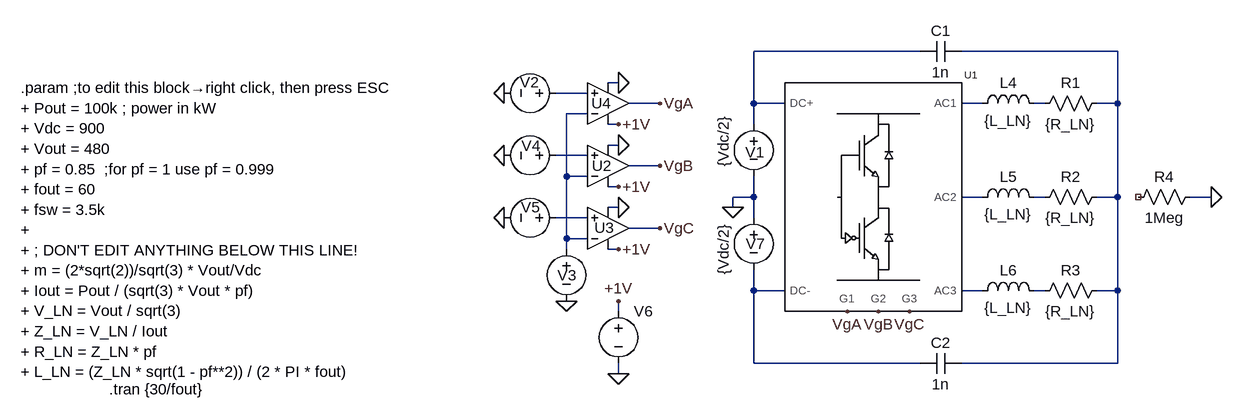
[diagram p0: schematic Inverter using B6CI block.asc]
Inverter using B6CI block.asc, the LTspice schematic file:
Version 4
SHEET 1 1528 680
WIRE 240 -80 -16 -80
WIRE 544 -80 304 -80
WIRE -224 -32 -240 -32
WIRE -272 -16 -320 -16
WIRE -160 0 -208 0
WIRE -16 0 -16 -80
WIRE 32 0 -16 0
WIRE 336 0 304 0
WIRE 432 0 416 0
WIRE 544 0 544 -80
WIRE 544 0 512 0
WIRE -272 16 -304 16
WIRE -224 32 -240 32
WIRE -16 32 -16 0
WIRE -224 64 -240 64
WIRE -272 80 -320 80
WIRE -160 96 -208 96
WIRE -304 112 -304 16
WIRE -272 112 -304 112
WIRE -224 128 -240 128
WIRE -16 144 -16 112
WIRE -16 144 -48 144
WIRE 336 144 304 144
WIRE 432 144 416 144
WIRE 544 144 544 0
WIRE 544 144 512 144
WIRE 688 144 656 144
WIRE -224 160 -240 160
WIRE -48 160 -48 144
WIRE -272 176 -320 176
WIRE -16 176 -16 144
WIRE -160 192 -208 192
WIRE -304 208 -304 112
WIRE -272 208 -304 208
WIRE -304 224 -304 208
WIRE -224 224 -240 224
WIRE -16 288 -16 256
WIRE 32 288 -16 288
WIRE 336 288 304 288
WIRE 432 288 416 288
WIRE 544 288 544 144
WIRE 544 288 512 288
WIRE -224 320 -224 304
WIRE -16 400 -16 288
WIRE 240 400 -16 400
WIRE 544 400 544 288
WIRE 544 400 304 400
WIRE -224 416 -224 400
FLAG -400 -16 0
FLAG -400 80 0
FLAG -400 176 0
FLAG -304 304 0
FLAG -224 32 +1V
FLAG -224 128 +1V
FLAG -224 224 +1V
FLAG -224 304 +1V
FLAG -224 416 0
FLAG -160 0 VgA
FLAG -160 96 VgB
FLAG -160 192 VgC
FLAG -224 -32 0
FLAG -224 64 0
FLAG -224 160 0
FLAG 688 144 0
FLAG 128 320 VgA
FLAG 176 320 VgB
FLAG 224 320 VgC
FLAG -48 160 0
SYMBOL IDEAL_B6CI 176 144 R0
SYMATTR InstName U1
SYMBOL voltage -16 16 R0
WINDOW 123 0 0 Left 2
WINDOW 39 0 0 Left 2
WINDOW 0 -13 59 Left 2
WINDOW 3 -46 4 VRight 2
SYMATTR InstName V1
SYMATTR Value {Vdc/2}
SYMBOL voltage -304 -16 R90
WINDOW 3 24 104 Invisible 2
WINDOW 123 0 0 Left 2
WINDOW 39 0 0 Left 2
WINDOW 0 -17 42 VRight 2
SYMATTR Value SINE(0 {m} {fout} 0 0 0)
SYMATTR InstName V2
SYMBOL voltage -304 208 R0
WINDOW 123 0 0 Left 2
WINDOW 39 0 0 Left 2
WINDOW 3 24 104 Invisible 2
WINDOW 0 -14 56 Left 2
SYMATTR Value PULSE(-1 1 0 {1/(2*fsw)} {1/(2*fsw)} 0 {1/fsw})
SYMATTR InstName V3
SYMBOL voltage -304 80 R90
WINDOW 3 24 104 Invisible 2
WINDOW 123 0 0 Left 2
WINDOW 39 0 0 Left 2
WINDOW 0 -15 40 VRight 2
SYMATTR Value SINE(0 {m} {fout} 0 0 120)
SYMATTR InstName V4
SYMBOL voltage -304 176 R90
WINDOW 3 24 104 Invisible 2
WINDOW 123 0 0 Left 2
WINDOW 39 0 0 Left 2
WINDOW 0 -16 41 VRight 2
SYMATTR Value SINE(0 {m} {fout} 0 0 240)
SYMATTR InstName V5
SYMBOL Opamps\\UniversalOpamp2 -240 96 M180
WINDOW 0 -25 0 Left 2
SYMATTR InstName U2
SYMBOL Opamps\\UniversalOpamp2 -240 192 M180
WINDOW 0 -21 1 Left 2
SYMATTR InstName U3
SYMBOL Opamps\\UniversalOpamp2 -240 0 M180
WINDOW 0 -26 0 Left 2
SYMATTR InstName U4
SYMBOL voltage -224 304 R0
WINDOW 3 24 104 Invisible 2
WINDOW 123 0 0 Left 2
WINDOW 39 0 0 Left 2
SYMATTR Value 1
SYMATTR InstName V6
SYMBOL ind 320 16 R270
WINDOW 0 32 56 VTop 2
WINDOW 3 5 56 VBottom 2
SYMATTR InstName L4
SYMATTR Value {L_LN}
SYMBOL ind 320 160 R270
WINDOW 0 32 56 VTop 2
WINDOW 3 5 56 VBottom 2
SYMATTR InstName L5
SYMATTR Value {L_LN}
SYMBOL ind 320 304 R270
WINDOW 3 5 56 VBottom 2
WINDOW 0 32 56 VTop 2
SYMATTR Value {L_LN}
SYMATTR InstName L6
SYMBOL res 416 16 R270
WINDOW 0 32 56 VTop 2
WINDOW 3 0 56 VBottom 2
SYMATTR InstName R1
SYMATTR Value {R_LN}
SYMBOL res 416 160 R270
WINDOW 0 32 56 VTop 2
WINDOW 3 0 56 VBottom 2
SYMATTR InstName R2
SYMATTR Value {R_LN}
SYMBOL res 416 304 R270
WINDOW 0 32 56 VTop 2
WINDOW 3 0 56 VBottom 2
SYMATTR InstName R3
SYMATTR Value {R_LN}
SYMBOL res 560 160 R270
WINDOW 0 32 56 VTop 2
WINDOW 3 0 56 VBottom 2
SYMATTR InstName R4
SYMATTR Value 1Meg
SYMBOL voltage -16 160 R0
WINDOW 123 0 0 Left 2
WINDOW 39 0 0 Left 2
WINDOW 0 -12 56 Left 2
WINDOW 3 -46 26 VRight 2
SYMATTR InstName V7
SYMATTR Value {Vdc/2}
SYMBOL cap 304 -96 R90
WINDOW 0 0 32 VBottom 2
WINDOW 3 32 32 VTop 2
SYMATTR InstName C1
SYMATTR Value 1n
SYMATTR SpiceLine Rser=0.01
SYMBOL cap 304 384 R90
WINDOW 0 0 32 VBottom 2
WINDOW 3 32 32 VTop 2
SYMATTR InstName C2
SYMATTR Value 1n
SYMATTR SpiceLine Rser=0.01
TEXT -1144 -24 Left 2 !.param ;to edit this block→right click, then press ESC\n+ Pout = 100k ; power in kW\n+ Vdc = 900\n+ Vout = 480\n+ pf = 0.85  ;for pf = 1 use pf = 0.999\n+ fout = 60\n+ fsw = 3.5k\n+ \n+ ; DON'T EDIT ANYTHING BELOW THIS LINE!\n+ m = (2*sqrt(2))/sqrt(3) * Vout/Vdc\n+ Iout = Pout / (sqrt(3) * Vout * pf)\n+ V_LN = Vout / sqrt(3)\n+ Z_LN = V_LN / Iout\n+ R_LN = Z_LN * pf\n+ L_LN = (Z_LN * sqrt(1 - pf**2)) / (2 * PI * fout)
TEXT -1008 440 Left 2 !.tran {30/fout}

The netlist it stands for:
* Inverter using B6CI block.asc
XU1 N001 N011 N004 N008 N012 VgA VgB VgC IDEAL_B6CI  ; pins DC+ DC- AC1 AC2 AC3 G1 G2 G3
V1 N001 0 {Vdc/2}
V2 N003 0 SINE(0 {m} {fout} 0 0 0)
V3 N006 0 PULSE(-1 1 0 {1/(2*fsw)} {1/(2*fsw)} 0 {1/fsw})
V4 N007 0 SINE(0 {m} {fout} 0 0 120)
V5 N010 0 SINE(0 {m} {fout} 0 0 240)
XU2 N007 N006 +1V 0 VgB level.2 Avol=1Meg GBW=10Meg Slew=10Meg ilimit=25m rail=0 Vos=0 phimargin=45 en=0 enk=0 in=0 ink=0 Rin=500Meg  ; pins IN+ IN- V+ V- OUT
XU3 N010 N006 +1V 0 VgC level.2 Avol=1Meg GBW=10Meg Slew=10Meg ilimit=25m rail=0 Vos=0 phimargin=45 en=0 enk=0 in=0 ink=0 Rin=500Meg  ; pins IN+ IN- V+ V- OUT
XU4 N003 N006 +1V 0 VgA level.2 Avol=1Meg GBW=10Meg Slew=10Meg ilimit=25m rail=0 Vos=0 phimargin=45 en=0 enk=0 in=0 ink=0 Rin=500Meg  ; pins IN+ IN- V+ V- OUT
V6 +1V 0 1
L4 N004 N005 {L_LN}
L5 N008 N009 {L_LN}
L6 N012 N013 {L_LN}
R1 N005 N002 {R_LN}
R2 N009 N002 {R_LN}
R3 N013 N002 {R_LN}
R4 NC_01 0 1Meg
V7 0 N011 {Vdc/2}
C1 N002 N001 1n Rser=0.01
C2 N002 N011 1n Rser=0.01
.param ;to edit this block→right click, then press ESC
+ Pout = 100k ; power in kW
+ Vdc = 900
+ Vout = 480
+ pf = 0.85  ;for pf = 1 use pf = 0.999
+ fout = 60
+ fsw = 3.5k
+
+ ; DON'T EDIT ANYTHING BELOW THIS LINE!
+ m = (2*sqrt(2))/sqrt(3) * Vout/Vdc
+ Iout = Pout / (sqrt(3) * Vout * pf)
+ V_LN = Vout / sqrt(3)
+ Z_LN = V_LN / Iout
+ R_LN = Z_LN * pf
+ L_LN = (Z_LN * sqrt(1 - pf**2)) / (2 * PI * fout)
.tran {30/fout}
.lib IDEAL_IGBT.lib
.lib UniversalOpamps2.sub
.backanno
.end